# EAGLE schematic CANNode (EAGLE 7.4.0)
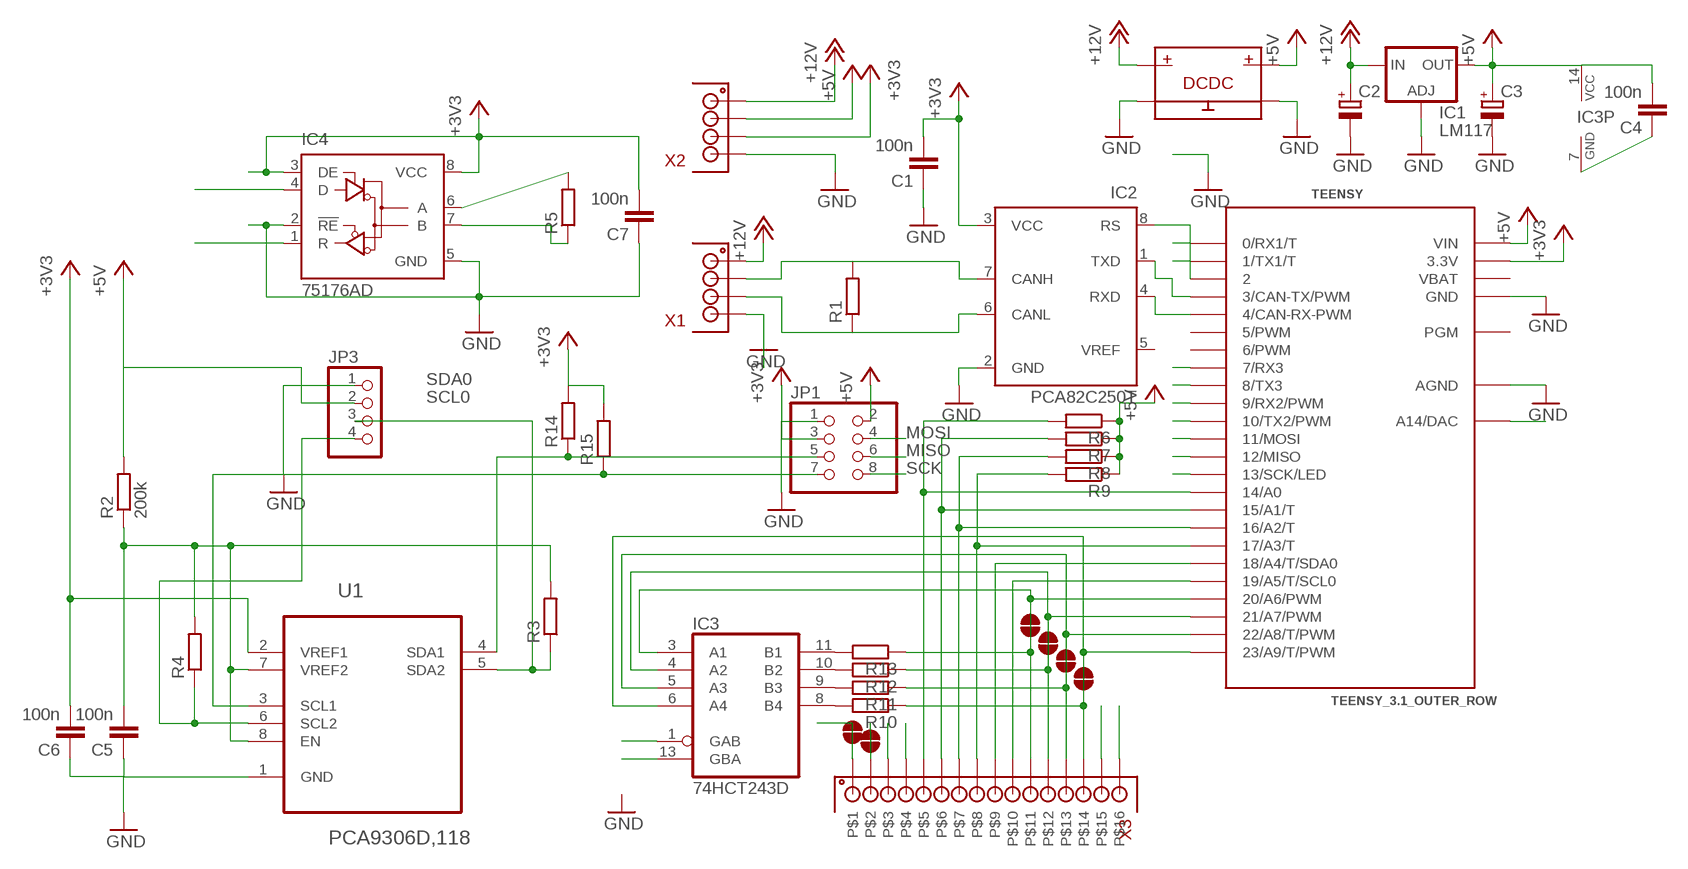
[diagram p0: schematic, sheet 1]

## Parts
C1  100n  C-EUC0805  [C0805]
C2  CPOL-EUA/3216-18W  [A/3216-18W]
C3  CPOL-EUA/3216-18W  [A/3216-18W]
C4  100n  C-EUC0805  [C0805]
C5  100n  C-EUC0805  [C0805]
C6  100n  C-EUC0805  [C0805]
C7  100n  C-EUC0805  [C0805]
IC1  LM117  LD117AS50TR  [SOT223]
IC2  PCA82C250T  [SO8]
IC3  74HCT243D  [SO14]
IC4  75176AD  [D_R-PDSO-G8]
JP1  PINHD-2X4  [2X04]
JP3  PINHD-1X4  [1X04]
MOD1  DCDC  [DC-DC]
R1  R-EU_R0805W  [R0805W]
R2  200k  R-EU_R0805W  [R0805W]
R3  R-EU_R0805W  [R0805W]
R4  R-EU_R0805W  [R0805W]
R5  R-EU_R0805W  [R0805W]
R6  R-EU_R0805W  [R0805W]
R7  R-EU_R0805W  [R0805W]
R8  R-EU_R0805W  [R0805W]
R9  R-EU_R0805W  [R0805W]
R10  R-EU_R0805W  [R0805W]
R11  R-EU_R0805W  [R0805W]
R12  R-EU_R0805W  [R0805W]
R13  R-EU_R0805W  [R0805W]
R14  R-EU_R0805W  [R0805W]
R15  R-EU_R0805W  [R0805W]
TEENSY  TEENSY_3.1_OUTER_ROW  [TEENSY3-OUTER_ROW]
U1  PCA9306D,118  [SOIC127P600X175-8N]
U$2  2-WAY_BRIDGE  [2-WAY_BRIDGE]
U$3  2-WAY_BRIDGE  [2-WAY_BRIDGE]
U$4  2-WAY_BRIDGE  [2-WAY_BRIDGE]
U$5  2-WAY_BRIDGE  [2-WAY_BRIDGE]
U$14  2-WAY_BRIDGE  [2-WAY_BRIDGE]
U$15  2-WAY_BRIDGE  [2-WAY_BRIDGE]
X1  KF141-P4  [KF141V-P4]
X2  KF141-P4  [KF141V-P4]
X3  KF141-P16  [KF141V-P16]

## Nets
+3V3: C1.2 C6.2 C7.2 IC2.3(VCC) IC4.3(DE) IC4.8(VCC) JP1.3 R14.2 R15.2 TEENSY.3.3V TEENSY.3.3V1(3.3V) U1.2(VREF1) X2.P$103 X2.P$203
+5V: C3.+ C4.2 IC1.4(OUT) IC3.14(VCC) JP1.2 JP3.2 MOD1.OUT+ R2.2 R6.1 R7.1 R8.1 R9.1 TEENSY.VIN X2.P$102 X2.P$202
+12V: C2.+ IC1.3(IN) MOD1.IN+ X1.P$101 X1.P$201 X2.P$101 X2.P$201
A14: TEENSY.RESET/DAC(A14/DAC) X3.P$103 X3.P$203
GND: C1.1 C2.- C3.- C4.1 C5.1 C6.1 C7.1 IC1.1(ADJ) IC2.2(GND) IC4.2(!RE) IC4.5(GND) JP1.1 JP3.1 MOD1.IN- MOD1.OUT- TEENSY.AGND TEENSY.GND TEENSY.GND1(GND) U1.1(GND) X1.P$104 X1.P$204 X2.P$104 X2.P$204
MISO: JP1.6 TEENSY.12(12/MISO)
MOSI: JP1.4 TEENSY.11(11/MOSI)
N$1: IC2.1(TXD) TEENSY.3(3/CAN-TX/PWM)
N$2: IC2.4(RXD) TEENSY.4(4/CAN-RX-PWM)
N$3: IC2.7(CANH) R1.2 X1.P$102 X1.P$202
N$4: IC3.8(B4) R10.2
N$5: IC3.9(B3) R11.2
N$6: R12.1 U$3.B X3.P$112 X3.P$212
N$9: IC3.3(A1) R13.1 TEENSY.20/A6(20/A6/PWM) U$2.A U$2.B X3.P$111 X3.P$211
N$10: IC3.10(B2) R12.2
N$11: IC2.8(RS) TEENSY.2
N$12: C5.2 R2.1 R3.2 R4.2 U1.7(VREF2) U1.8(EN)
N$13: R9.2 TEENSY.17/A3(17/A3/T) X3.P$108 X3.P$208
N$14: R8.2 TEENSY.16/A2(16/A2/T) X3.P$107 X3.P$207
N$15: R7.2 TEENSY.15/A1(15/A1/T) X3.P$106 X3.P$206
N$16: R6.2 TEENSY.14/A0 X3.P$105 X3.P$205
N$17: R10.1 U$5.B X3.P$114 X3.P$214
N$18: IC3.5(A3) R11.1 TEENSY.22/A8(22/A8/T/PWM) U$4.A U$4.B X3.P$113 X3.P$213
N$19: IC3.4(A2) TEENSY.21/A7(21/A7/PWM) U$3.A
N$20: IC2.6(CANL) R1.1 X1.P$103 X1.P$203
N$21: IC3.11(B1) R13.2
N$25: IC3.6(A4) TEENSY.23/A9(23/A9/T/PWM) U$5.A
RX1: TEENSY.0(0/RX1/T) X3.P$116 X3.P$216
RX2: IC4.1(R) IC4.6(A) R5.2 TEENSY.9(9/RX2/PWM) U$15.A U$15.B X3.P$102 X3.P$202
RX3: IC3.13(GBA) TEENSY.7(7/RX3)
SCK: JP1.8 TEENSY.13(13/SCK/LED) X3.P$104 X3.P$204
SCL0: JP1.7 R15.1 TEENSY.19/A5(19/A5/T/SCL0) U1.3(SCL1) X3.P$110 X3.P$210
SCL_5V: JP3.4 R4.1 U1.6(SCL2)
SDA0: JP1.5 R14.1 TEENSY.18/A4(18/A4/T/SDA0) U1.4(SDA1) X3.P$109 X3.P$209
SDA_5V: JP3.3 R3.1 U1.5(SDA2)
TX1: TEENSY.1(1/TX1/T) X3.P$115 X3.P$215
TX2: IC4.4(D) IC4.7(B) R5.1 TEENSY.10(10/TX2/PWM) U$14.A U$14.B X3.P$101 X3.P$201
TX3: IC3.1(GAB) TEENSY.8(8/TX3)
Unconnected: IC2.5(VREF) TEENSY.5(5/PWM) TEENSY.6(6/PWM) TEENSY.PGM

## Power pins joined to a net without a drawn wire
GND: IC3.7(GND)
VBAT: TEENSY.VBAT

## Library data of the parts
C1 C4-C7 = rcl:C-EU: CAPACITOR, European symbol
C2 C3 = rcl:CPOL-EU: POLARIZED CAPACITOR, European symbol
IC1 = v-reg:LD117A?*: Low drop fixed and adjustable positive voltage regulators 1 A Source: http://www.st.com/stonline/products/literature/ds/7194/ld1117axx.pdf
IC2 = micro-philips_own:PCA82C250: CAN CONTROLLER INTERFACE; OC_FARNELL: 1085275; OC_NEWARK: unknown
IC3 = 74xx-eu:74*243: Quadruple BUS TRANSCEIVER
IC4 = 751xx:75176A: DIFFERENTIAL BUS TRANSCEIVER Source: http://focus.ti.com/lit/ds/symlink/sn75176a.pdf
JP1 = adafruit:PINHD-2X4: PIN HEADER
JP3 = own_pinhead:PINHD-1X4: PIN HEADER
MOD1 = own:DCDC
R1-R9 R11-R15 = resistor:R-EU_: RESISTOR, European symbol
R10 = rcl:R-EU_: RESISTOR, European symbol
TEENSY = Teensy_3_and_LC_Series_Boards_v1.0:TEENSY_3.1_OUTER_ROW: Footprint for Teensy 3.1 or 3.2 board using all pin connections on the outer perimeter
U1 = PCA9306D_118:PCA9306D,118: Dual bidirectional I2C-bus and SMBus voltage-level translator; MPN: PCA9306D,118; OC_FARNELL: 1831194; OC_NEWARK: 70R6428; PACKAGE: SOIC-8; SUPPLIER: NXP
U$2-U$5 U$14 U$15 = own:2-WAY_BRIDGE
X1 X2 = own:KF141-P4
X3 = own_002:KF141-P16

## Net classes
0 default: clearance 0.205 mm